# Altium schematic sheet Regulator.SchDoc
size A; SheetNumber: 1; SheetTotal: 1
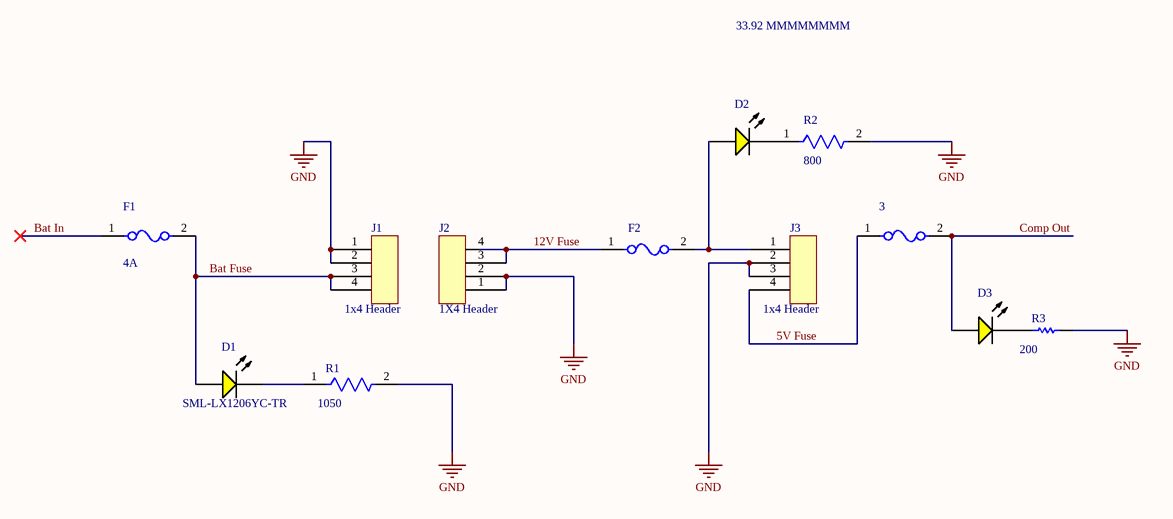
[diagram p0: Regulator.SchDoc]

## Parts
3  5A  [FP-0469-MFG]  (value not drawn)
D1  SML-LX1206YC-TR  [LUMX-SML-LX1206YC-TR_V]
D2  SML-LX1206YC-TR  [LUMX-SML-LX1206YC-TR_V]  (value not drawn)
D3  SML-LX1206YC-TR  [LUMX-SML-LX1206YC-TR_V]  (value not drawn)
F1  4A  [FP-0685T-IPC_B]
F2  3A  [FP-0466-MFG]  (value not drawn)
J1  1x4 Header  [1X4 HEADER]
J2  1X4 Header  [1X4 HEADER]
J3  1x4 Header  [1X4 HEADER]
R1  1050  [FP-CR1206-IPC_B]
R2  800  [FP-MCA1206-IPC_C]
R3  200  [RESC3216X70X50LL05T20]

## Nets
GND: J1.1 J1.2 J2.1 J2.2 J3.2 J3.3 R1.2 R2.2 R3.2
5V Fuse: 3.1 J3.4
12V Fuse: F2.1 J2.3 J2.4
Bat Fuse: D1.1(A) F1.2 J1.3 J1.4
Bat In: F1.1
Comp Out: 3.2 D3.1(A)
NetD1_2: D1.2(K) R1.1
NetD2_1: D2.1(A) F2.2 J3.1
NetD2_2: D2.2(K) R2.1
NetD3_2: D3.2(K) R3.1

## Notes on the sheet
- 33.92 MMMMMMMM

## Library data of the parts
3 = CMP-08605-000100-1: FUSE BOARD MOUNT 5A 32VDC 1206; Approvals: UL; Voltage Rating (DC): 32V; Blow Characteristic: TIME DELAY; DC Cold Resistance: 35mR; Power Dissipation: 1.08W; Fuse Type: Board Mount (Cartridge Style Excluded); Body Material: Ceramic; Max Operating Temperature: 150°C; Depth: 1.63mm; Radiation Hardening: No; Height: 0.9mm; Number of Pins: 2; Resistor Type: Ceramic; Terminal Material: Nickel; Case/Package: 1206; Resistance: 35mR; RoHS Compliant: Yes; Lead Free: Lead Free; Housing Material: Ceramic; Packaging: Tape and Reel; Width: 1.63mm; Mount: Surface Mount; Min Operating Temperature: -55°C; Working Voltage: 32V; Series: 469; Package Quantity: 3000; Termination: SMD/SMT; Size: 0.9mm; Case Code (Imperial): 1206; Current Rating: 5A; Case Code (Metric): 3216; Voltage Rating: 32V; Length: 3.27mm; Fuse Current: 5A
D1-D3 = CMP-2000-07124-1: Yellow LED, Water Clear Len, 585 nm, 2.1 V, -40 to 85 degC, 2-Pin SMD, RoHS, Tape and Reel; Manufacturer: Lumex; Product Training Modules: LEDsBenefitsofCustomLEDandLCDTechnology; Millicandela Rating: 6mcd; Catalog Drawings: SML-LX1206SeriesTopSML-LX1206SeriesSideSML-LX1206SeriesBottomSML-LX1206SeriesFootprint; Wavelength - Peak: 585nm; Other Names: 67-1358-2LU60357TRSMLLX1206YCTR; Lens Style/Size: RectanglewithFlatTop; Current - Test: 20mA; Lens Color: Colorless; Viewing Angle: 160°; Voltage - Forward (Vf) (Typ): 2.1V; Online Catalog: SML-LX1206RectanglewithFlatTop1206PackageLEDs; Mounting Type: SurfaceMount; Package Description: 2-Pin Surface Mount Device, Body 3.2 x 1.5 mm; Datasheet Version: Rev. K, 08/2012; Features: -; Color: Yellow; RoHS Information: RoHSCertofCompliance; Package Reference: SML-LX1206YC-TR; Supplier Device Package: 1206; Standard Package: 3,000; Series: -; Wavelength - Dominant: -; Package / Case: 1206(3216Metric); Mounting Technology: SurfaceMount; Height (Max): 1.10mm; Lens Transparency: Clear; Datasheet URL: http://www.lumex.com/content/files/ProductAttachment/SML-LX1206YC-TR.pdf; Family: LEDIndication-Discrete; Manufacturer URL: http://www.lumexinstruments.com/; Packaging: Tape&Reel(TR); Category: Optoelectronics; Size / Dimension: 3.20mmLx1.60mmW
F1 = CMP-16042-000023-1: 4A 63V AC 63V DC Fuse Board Mount (Cartridge Style Excluded) Surface Mount 1206 (3216 Metric); Approvals: CE; DC Cold Resistance: 30mR; Current Rating: 4A; Voltage Rating (AC): 63V; Case Code (Metric): 3216; Packaging: Cut Tape; Mount: Surface Mount; Fuse Type: Board Mount (Cartridge Style Excluded); Min Operating Temperature: -55°C; Case/Package: 1206; Max Operating Temperature: 125°C; Case Code (Imperial): 1206; Voltage Rating (DC): 63V; RoHS Compliant: Yes
F2 = CMP-08605-000054-1: FUSE BOARD MNT 3A 32VAC/VDC 1206; Manufacturer Part Number: 0466003.NR; Manufacturer: Littelfuse; Fuse Interrupt Ac Current: 50A; Fuse Voltage Drop: 75.99mV; Max Fuse Ac Voltage: 32V; Fuse I2T: 0.576A2Sec; Resistance: 0.019Ω; Fuse Blow Speed: Fast; Value: 0.019Ω; ComponentLink2Description: Datasheet; Fuse Current: 3A; RoHS: TRUE; Mouser Description: Surface Mount Fuses 32V 3A VFA Slimline; Height: 0.66mm; Octopart: https://octopart.com/0466003.nr-littelfuse-565175; Package: 0466; Fuse Interrupt Dc Current: 50A; Temperature Range Low: -55°C; ComponentLink2URL: https://www.littelfuse.com/~/media/electronics/datasheets/fuses/littelfuse_fuse_466_datasheet.pdf.pdf; Digikey Description: FUSE BOARD MNT 3A 32VAC/VDC 1206; Voltage Rating: 32V; Category: Fuse; Lead Free: Yes; Device Class L2: Fuses; Automotive: No; Max Fuse Dc Voltage: 32V; Temperature Range High: +90°C; Device Class L3: unset; Device Class L1: Circuit Protection; Temperature: -55°C to +90°C
J1-J3 = 1X4 Header: CONN HEADER VERT 4POS 2.54MM; Manufacturer: Würth Elektronik; Manufacturer Part Number: 61300411121; Value: 1x4 Header
R1 = CMP-07231-003381-1: Thick Film Chip Resistors 1206 1.05kΩ 0.25W 1% 100ppm/°C; Power Rating: 250mW; Voltage Rating: 200V; Resistance: 1.05kR; Max Operating Temperature: 155°C; Package Quantity: 5000; Height: 0.03inch; Features: Moisture Resistant; Contact Plating: Tin; Packaging: Tape and Reel; Number of Terminations: 2; Thickness: 610um; Case/Package: 1206; Case Code (Metric): 3216; Depth: 1.6mm; Radiation Hardening: No; Military Standard: Not; Width: 0.063inch; Temperature Coefficient: 100ppm/°C; Composition: Thick Film; Case Code (Imperial): 1206; Tolerance: 1%; Max Power Dissipation: 250mW; Length: 3.2mm; Min Operating Temperature: -55°C; Termination: SMD/SMT; Mount: Surface Mount
R2 = CMP-02407-008722-1: Res MC Precision Thin Film 1206 800Ω 0.1% 0.25W ±25ppm/°C Molded Paper T/R; Resistance: 800R; Max Power Dissipation: 250mW; Lead Free: Lead Free; Package Quantity: 5000; Composition: Thin Film; Tolerance: 0.1%; Number of Terminations: 2; Length: 0.126inch; Width: 0.063inch; Max Operating Temperature: 125°C; Packaging: Tape and Reel; Min Operating Temperature: -55°C; Case/Package: 1206; Temperature Coefficient: 25ppm/°C; Height: 0.026inch
R3 = CMP-2003-00580-1: Part Number: ERJ-8GEYJ201V; Manufacturer: Panasonic